# Altium schematic sheet SIM900.SchDoc
size A; SheetNumber: 2; SheetTotal: 9
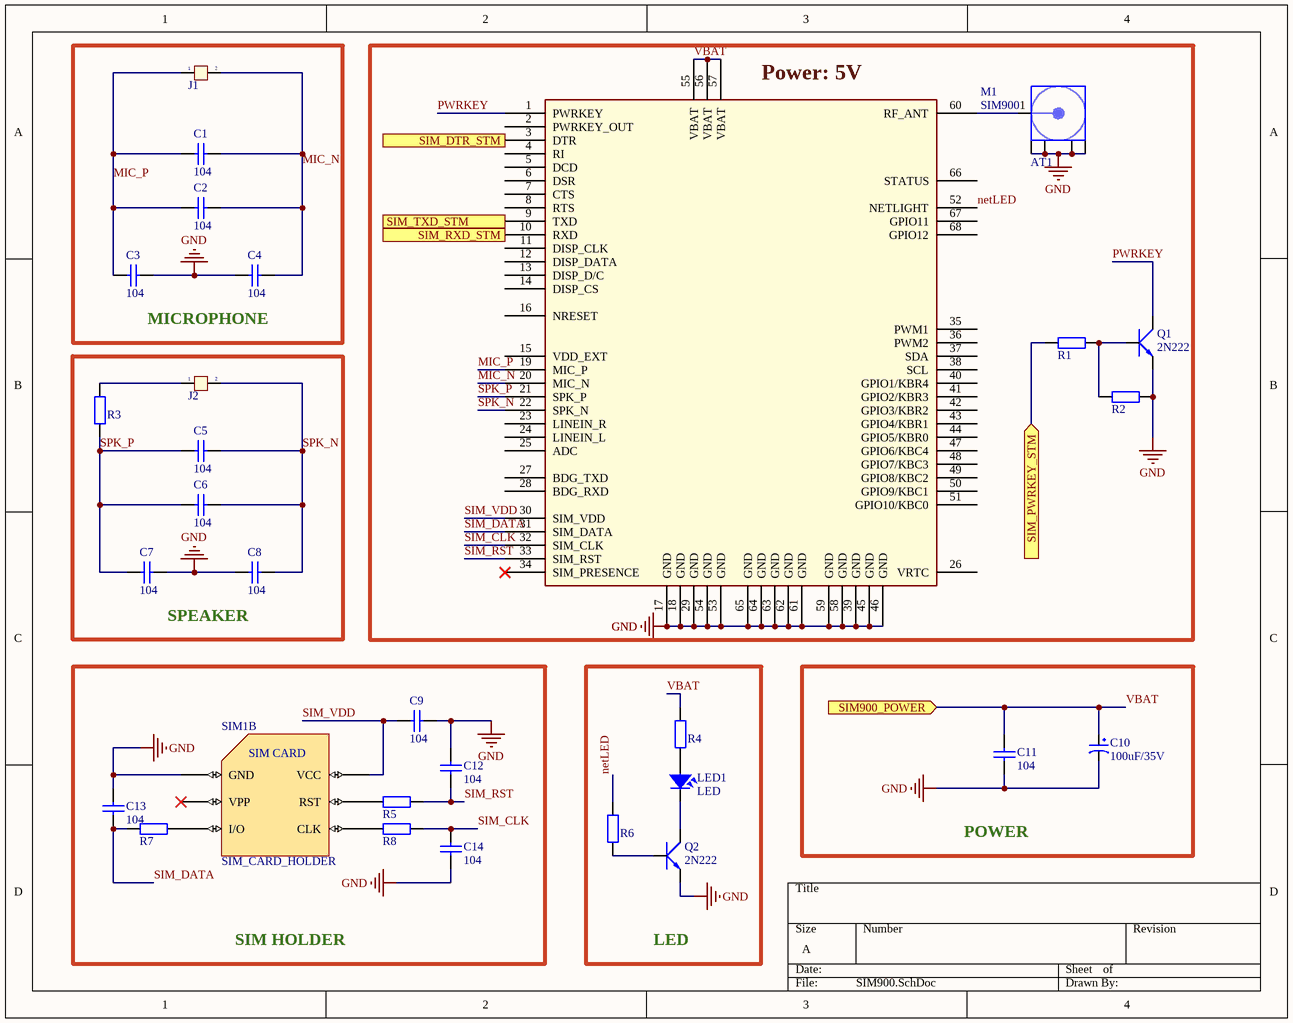
[diagram p0: SIM900.SchDoc]

## Parts
AT1  AT-GSM-GPS  [SNW_H13-L17-SMA]  (value not drawn)
C1  104  [0805]
C2  104  [0805]
C3  104  [0805]
C4  104  [0805]
C5  104  [0805]
C6  104  [0805]
C7  104  [0805]
C8  104  [0805]
C9  104  [0805]
C10  100uF/35V  [CP1.5/3.4]
C11  104  [0805]
C12  104  [0805]
C13  104  [0805]
C14  104  [0805]
J1  Jumper 2  [JP2]  (value not drawn)
J2  Jumper 2  [JP2]  (value not drawn)
LED1  LED  [SM-LED-1206-Green]
M1  SIM900  [SIM900]
Q1  2N222  [SOT23-231]
Q2  2N222  [SOT23-231]
R1  1k  [RES-SMD-0101]  (value not drawn)
R2  1k  [RES-SMD-0101]  (value not drawn)
R3  1k  [RES-SMD-0101]  (value not drawn)
R4  1k  [RES-SMD-0101]  (value not drawn)
R5  1k  [RES-SMD-0101]  (value not drawn)
R6  1k  [RES-SMD-0101]  (value not drawn)
R7  1k  [RES-SMD-0101]  (value not drawn)
R8  1k  [RES-SMD-0101]  (value not drawn)
SIM1  SIM_CARD_HOLDER  [SIM_HOLDER]  (part B of 2)

## Blocks framed on the sheet
MICROPHONE: C1-C4 J1
Power: 5V: AT1 M1 Q1 R1 R2
SPEAKER: C5-C8 J2 R3
SIM HOLDER: C9 C12-C14 R5 R7 R8 SIM1
LED: LED1 Q2 R4 R6
POWER: C10 C11

## Ports
SIM900_POWER (in), SIM_DTR_STM (in), SIM_PWRKEY_STM (in), SIM_RXD_STM (in), SIM_TXD_STM (out)

## Nets
GND: AT1.2 C3.2 C4.2 C7.2 C8.1 C9.1 C10.2 C11.1 C12.1 C13.2 C14.2 M1.17(GND) M1.18(GND) M1.29(GND) M1.39(GND) M1.45(GND) M1.46(GND) M1.53(GND) M1.54(GND) M1.58(GND) M1.59(GND) M1.61(GND) M1.62(GND) M1.63(GND) M1.64(GND) M1.65(GND) Q1.1(E) Q2.1(E) R2.2 SIM1.224(GND)
MIC_N: C1.1 C2.1 C4.1 J1.2 M1.20(MIC_N)
MIC_P: C1.2 C2.2 C3.1 J1.1 M1.19(MIC_P)
netLED: M1.52(NETLIGHT) R6.2
PWRKEY: M1.1(PWRKEY) Q1.3(C)
SIM_CLK: C14.1 M1.32(SIM_CLK) R8.1
SIM_DATA: C13.1 M1.31(SIM_DATA) R7.2
SIM_DTR_STM: M1.3(DTR) ; port SIM_DTR_STM
SIM_PWRKEY_STM: R1.1 ; port SIM_PWRKEY_STM
SIM_RST: C12.2 M1.33(SIM_RST) R5.1
SIM_RXD_STM: M1.10(RXD) ; port SIM_RXD_STM
SIM_TXD_STM: M1.9(TXD) ; port SIM_TXD_STM
SIM_VDD: C9.2 M1.30(SIM_VDD) SIM1.227(VCC)
SPK_N: C5.2 C6.2 C8.2 J2.2 M1.22(SPK_N)
SPK_P: C5.1 C6.1 C7.1 M1.21(SPK_P) R3.2
VBAT: C10.1 C11.2 M1.55(VBAT) M1.56(VBAT) M1.57(VBAT) R4.1 ; port SIM900_POWER
NetAT1_1: AT1.1(Signal) M1.60(RF_ANT)
NetJ2_1: J2.1 R3.1
NetLED1_1: LED1.1 R4.2
NetLED1_2: LED1.2 Q2.3(C)
NetQ1_2: Q1.2(B) R1.2 R2.1
NetQ2_2: Q2.2(B) R6.1
NetR5_2: R5.2 SIM1.228(RST)
NetR7_1: R7.1 SIM1.226(I/O)
NetR8_2: R8.2 SIM1.229(CLK)

Not connected (* = marked no-connect by the designer): M1 2(PWRKEY_OUT) 4(RI) 5(DCD) 6(DSR) 7(CTS) 8(RTS) 11(DISP_CLK) 12(DISP_DATA) 13(DISP_D/C) 14(DISP_CS) 15(VDD_EXT) 16(NRESET) 23(LINEIN_R) 24(LINEIN_L) 25(ADC) 26(VRTC) 27(BDG_TXD) 28(BDG_RXD) 34(SIM_PRESENCE)* 35(PWM1) 36(PWM2) 37(SDA) 38(SCL) 40(GPIO1/KBR4) 41(GPIO2/KBR3) 42(GPIO3/KBR2) 43(GPIO4/KBR1) 44(GPIO5/KBR0) 47(GPIO6/KBC4) 48(GPIO7/KBC3) 49(GPIO8/KBC2) 50(GPIO9/KBC1) 51(GPIO10/KBC0) 66(STATUS) 67(GPIO11) 68(GPIO12); SIM1 225(VPP)*

## Notes on the sheet
- (in symbol SIM_CARD_HOLDER, part B) SIM CARD

## Library data of the parts
AT1 = SNW_H13-L17-SMA: CONNECTER ANTENNA GPS GSM; MFR: Sunny Way; Solder: HAND; MPN: SNW_H13-L17-SMA; Value: AT-GSM-GPS
C1-C9 C11-C14 = Cap 104_SMD: Capacitor (Semiconductor SIM Model); Value: 0.1uF; Published: 8-Jun-2000; LatestRevisionDate: 17-Jul-2002; LatestRevisionNote: Re-released for DXP Platform.; PackageReference: C1206; Publisher: Altium Limited
C10 = CP3: Cap 100uF/35V - 470uF/16V; Value: 100uF/35V/50V; Description 1: 1000uF/6,3V - 470uF/16V - 330uF - 25V; Description 2: 220uF/35V - 100uF/50V - 63V - 4,7uF/200V; Description 3: 22uF => 33uF100V - 3,3uF => 4,7uF/250V; Description 4: 2,2uF =>3,3uF/350 - 2,2uF/400V - 1uF/450V
J1 J2 = JP 2: Value: JP 2
M1 = SIM900: Quad-band GSM/GPRS module
Q1 Q2 = 2N222: NPN 600mW, ECB; Value: C1815
R1-R8 = R: Resistor R1/4W